# Altium schematic sheet 12V Input Protecion.SchDoc
size A; SheetNumber: 1; SheetTotal: 5
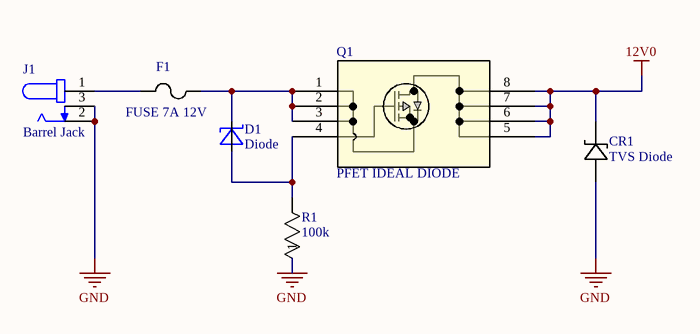
[diagram p0: 12V Input Protecion.SchDoc]

## Parts
CR1  TVS Diode  [DO-214AASMB_J-BEND_LTF]
D1  Diode  [SOD123]
F1  FUSE 7A 12V  [FUSE_2920L70012_LTF]
J1  Barrel Jack  [CUI_PJ-102AH]
Q1  PFET IDEAL DIODE  [POWERPAK_SO-8_SINGLE_VIS]
R1  100k  [RC0805N_YAG]

## Nets
12V0: CR1.1 Q1.5(D) Q1.6(D) Q1.7(D) Q1.8(D)
GND: CR1.2 J1.2 J1.3 R1.1
NetD1_A: D1.A Q1.4(G) R1.2
NetD1_C: D1.C F1.2 Q1.1(S) Q1.2(S) Q1.3(S)
NetF1_1: F1.1 J1.1

## Library data of the parts
CR1 = SMBJ15A: Description; Manufacturer_Name: Littelfuse Inc; Copyright: Copyright (C) 2025 Ultra Librarian. All rights reserved.; Manufacturer_Part_Number: SMBJ15A
D1 = BZT52C15-7-F: Zener Diode 15V 6.1% 500mW SOD123 | Diodes Inc BZT52C15-7-F; MF: Diodes Inc.; SnapEDA_Link: https://www.snapeda.com/parts/BZT52C15-7-F/Diodes+Inc./view-part/?ref=snap; Package: SOD-123 Fairchild Semiconductor; Value: *; MP: BZT52C15-7-F; Check_prices: https://www.snapeda.com/parts/BZT52C15-7-F/Diodes+Inc./view-part/?ref=eda
F1 = 2920L70012MR-A: Description; Manufacturer_Name: Littelfuse Inc; Manufacturer_Part_Number: 2920L700/12MR-A; Copyright: Copyright (C) 2025 Ultra Librarian. All rights reserved.
J1 = PJ-102AH: 2.0 x 6.5 mm, 5.0 A, Horizontal, Through Hole, Tapered Pins, Dc Power Jack Connector; MF: Same Sky; SnapEDA_Link: https://www.snapeda.com/parts/PJ-102AH/Same+Sky/view-part/?ref=snap; Package: None; Value: *; MP: PJ-102AH; Check_prices: https://www.snapeda.com/parts/PJ-102AH/Same+Sky/view-part/?ref=eda
Q1 = SIR4409DP-T1-RE3: P-CHANNEL 40-V (D-S) MOSFET; Manufacturer_Name: Vishay; Type: Transistors; Copyright: Copyright (C) 2025 Ultra Librarian. All rights reserved.; Manufacturer_Part_Number: SIR4409DP-T1-RE3; RefDes: RefDes
R1 = RC0805FR-07100KL: Description; Manufacturer_Name: Yageo; Copyright: Copyright (C) 2025 Ultra Librarian. All rights reserved.; Manufacturer_Part_Number: RC0805FR-07100KL